# EasyEDA Pro project all_pcb.eprj

# Schematic Schematic1
Board Name: 前置差分放大; Create Date: 2024-09-15
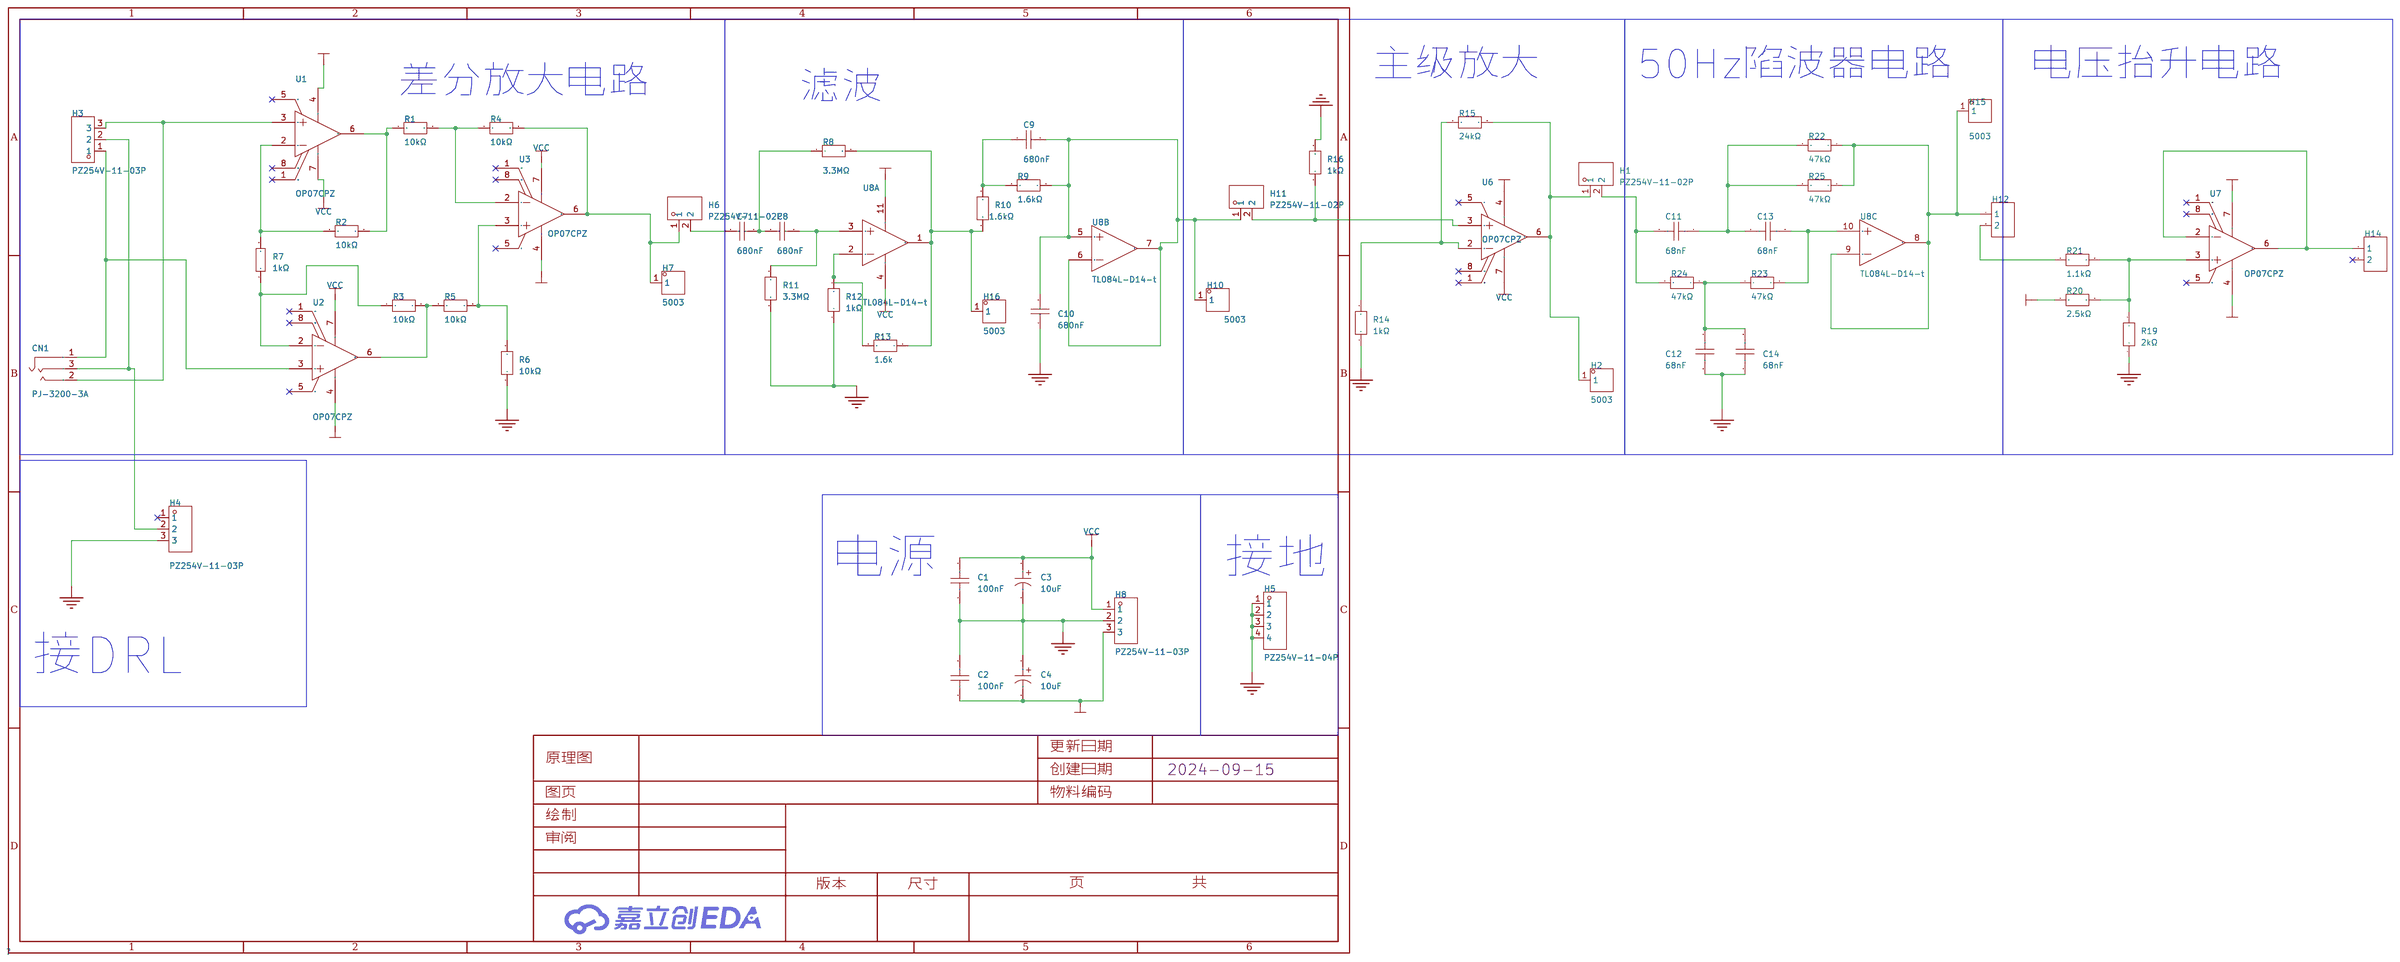
[diagram p0: schematic sheet]

## Parts
C1  100nF  [CAP-TH_L13.0-W6.0-P10.0-D0.6]
C2  100nF  [CAP-TH_L13.0-W6.0-P10.0-D0.6]
C3  10uF  [CAP-TH_BD10.0-P5.00-D0.6-FD]
C4  10uF  [CAP-TH_BD10.0-P5.00-D0.6-FD]
C7  680nF  [CAP-TH_L7.5-W6.5-P5.00-D0.5]
C8  680nF  [CAP-TH_L7.5-W6.5-P5.00-D0.5]
C9  680nF  [CAP-TH_L7.5-W6.5-P5.00-D0.5]
C10  680nF  [CAP-TH_L7.5-W6.5-P5.00-D0.5]
C11  68nF  [CAP-TH_L5.1-W3.8-P5.08-D1.2]
C12  68nF  [CAP-TH_L18.0-W8.0-P15.00-D0.8]
C13  68nF  [CAP-TH_L5.1-W3.8-P5.08-D1.2]
C14  68nF  [CAP-TH_L5.1-W3.8-P5.08-D1.2]
CN1  PJ-3200-3A  [AUDIO-TH_PJ-3200-3A]
H1  PZ254V-11-02P  [HDR-TH_2P-P2.54-V-M]
H2  5003  [TEST-TH_BD2.54-P1.39]
H3  PZ254V-11-03P  [HDR-TH_3P-P2.54-V-M]
H4  PZ254V-11-03P  [HDR-TH_3P-P2.54-V-M]
H5  PZ254V-11-04P  [HDR-TH_4P-P2.54-V-M]
H6  PZ254V-11-02P  [HDR-TH_2P-P2.54-V-M]
H7  5003  [TEST-TH_BD2.54-P1.39]
H8  PZ254V-11-03P  [HDR-TH_3P-P2.54-V-M]
H10  5003  [TEST-TH_BD2.54-P1.39]
H11  PZ254V-11-02P  [HDR-TH_2P-P2.54-V-M]
H12  -  [HDR-TH_2P-P2.54-V-F]
H14  -  [HDR-TH_2P-P2.54-V-F]
H15  5003  [TEST-TH_BD2.54-P1.39]
H16  5003  [TEST-TH_BD2.54-P1.39]
R1  10kΩ  [RES-TH_BD2.4-L6.3-P10.30-D0.6]
R2  10kΩ  [RES-TH_BD2.4-L6.3-P10.30-D0.6]
R3  10kΩ  [RES-TH_BD2.4-L6.3-P10.30-D0.6]
R4  10kΩ  [RES-TH_BD2.4-L6.3-P10.30-D0.6]
R5  10kΩ  [RES-TH_BD2.4-L6.3-P10.30-D0.6]
R6  10kΩ  [RES-TH_BD2.4-L6.3-P10.30-D0.6]
R7  1kΩ  [RES-TH_BD2.5-L6.5-P10.50-D0.6]
R8  3.3MΩ  [RES-TH_BD2.4-L6.3-P10.30-D0.6]
R9  1.6kΩ  [RES-TH_BD2.4-L6.3-P10.30-D0.6]
R10  1.6kΩ  [RES-TH_BD2.4-L6.3-P10.30-D0.6]
R11  3.3MΩ  [RES-TH_BD2.4-L6.3-P10.30-D0.6]
R12  1kΩ  [RES-TH_BD2.4-L6.3-P10.30-D0.6]
R13  1.6k  [RES-TH_BD2.4-L6.3-P10.30-D0.6]
R14  1kΩ  [RES-TH_BD2.4-L6.3-P10.30-D0.6]
R15  24kΩ  [RES-TH_BD2.4-L6.3-P10.30-D0.6]
R16  1kΩ  [RES-TH_BD2.4-L6.3-P10.30-D0.6]
R19  2kΩ  [RES-TH_BD2.3-L6.5-P10.50-D0.5]
R20  2.5kΩ  [RES-TH_BD4.6-L11.4-P15.40-D0.8]
R21  1.1kΩ  [RES-TH_BD3.3-L9.0-P13.00-D0.6]
R22  47kΩ  [RES-TH_BD2.3-L6.5-P10.50-D0.5]
R23  47kΩ  [RES-TH_BD2.4-L6.5-P10.50-D0.5]
R24  47kΩ  [RES-TH_BD2.4-L6.5-P10.50-D0.5]
R25  47kΩ  [RES-TH_BD3.3-L9.0-P13.00-D0.6]
U1  OP07CPZ  [PDIP-8_L9.3-W6.4-P2.54-LS7.6-BL]
U2  OP07CPZ  [PDIP-8_L9.3-W6.4-P2.54-LS7.6-BL]
U3  OP07CPZ  [PDIP-8_L9.3-W6.4-P2.54-LS7.6-BL]
U6  OP07CPZ  [PDIP-8_L9.3-W6.4-P2.54-LS7.6-BL]
U7  OP07CPZ  [PDIP-8_L9.3-W6.4-P2.54-LS7.6-BL]
U8  TL084L-D14-t  [PDIP-14_L19.3-W6.5-P2.54-LS7.6-BL]  (sections 1,2,3)

## Library data of the parts
C1 C2 = 1X2H410K275-11: LCSC Part Name: 等级:X2 100nF ±10% 275V; Supplier Part: C2846731; Manufacturer: BM(丰明电容); Supplier Footprint: 插件,P=10mm; JLCPCB Part Class: 扩展库; Datasheet: https://atta.szlcsc.com/upload/public/pdf/source/20210728/C2846732_DAC16FCBF90FAF4BF667A23B36E0C6E8.pdf; Supplier: LCSC; Tolerance: ±10%; Voltage(AC): 275V; Subclass: X2
C3 C4 = UCS2E100MPD1TD: LCSC Part Name: 10uF ±20% 250V; Supplier Part: C1579721; Manufacturer: Nichicon(尼吉康); Supplier Footprint: 插件; JLCPCB Part Class: 扩展库; Datasheet: https://atta.szlcsc.com/upload/public/pdf/source/20211009/4F4CA769B8C92F768087E64A1413DB40.pdf; Supplier: LCSC; Tolerance: ±20%; Rated Voltage: 250V; Ripple Current: 175mA@120Hz; Lead Spacing: 5mm; φD: 10mm; Lifetime @ Temp: 8000hrs@105℃; Operating Temperature: -40℃~+105℃
C7-C10 = PE684J2A0502: 容值:680nF;精度:±5%;额定电压:100V;工作温度:-40℃~+110℃;; LCSC Part Name: 680nF ±5% 100V; Supplier Part: C478437; Manufacturer: KYET(科雅); Supplier Footprint: 插件,P=5mm; JLCPCB Part Class: 扩展库; Datasheet: https://atta.szlcsc.com/upload/public/pdf/source/20200102/C478437_80764A5A52068CAA3BEDED5BEA089104.pdf; Supplier: LCSC; Tolerance: ±5%; Voltage Rated: 100V; Operating Temperature: -40℃~+110℃
C11 C13 C14 = C322C104KBR5TA: 容值:100nF;精度:±10%;额定电压:630V;温度系数:X7R;; LCSC Part Name: 100nF ±10% 630V; Supplier Part: C129685; Manufacturer: KEMET(基美); Supplier Footprint: 插件,P=5.08mm; JLCPCB Part Class: 扩展库; Datasheet: https://atta.szlcsc.com/upload/public/pdf/source/20180502/C129685_22A0E9A1A89AC8F69AAACD1F3AA6AB03.pdf; Supplier: LCSC; Tolerance: ±10%; Voltage Rated: 630V; Temperature Coefficient: X7R
C12 = B32922H3204M: 容值:200nF;精度:±20%;电压(AC):305V;等级:X2;; LCSC Part Name: 等级:X2 200nF ±20% 305V; Supplier Part: C3298878; Manufacturer: TDK; Supplier Footprint: 插件,P=15mm; JLCPCB Part Class: 扩展库; Datasheet: https://atta.szlcsc.com/upload/public/pdf/source/20240403/6B857094AE2B4215483F52CB5BD16209.pdf; Supplier: LCSC; Tolerance: ±20%; Voltage(AC): 305V; Subclass: X2; Operating Temperature: -40℃~+110℃
CN1 = PJ-3200-3A: LCSC Part Name: 3.5mm耳机座; Supplier Part: C709202; Manufacturer: 韩国韩荣; Supplier Footprint: 插件; JLCPCB Part Class: 扩展库; Datasheet: https://atta.szlcsc.com/upload/public/pdf/source/20201012/C709202_4DD47C61DF91E6337EB1570AC409C882.pdf; Supplier: LCSC; Connector Type: 3.5mm耳机座; Current Rating (Max): 500mA; Voltage Rating (Max): 30V; Operating Temperature Range: -20℃~+70℃
H1 H6 H11 = PZ254V-11-02P: LCSC Part Name: 间距:2.54mm 1x2P 直插 方针; Supplier Part: C492401; Manufacturer: XFCN(兴飞); Supplier Footprint: 插件,P=2.54mm; JLCPCB Part Class: 扩展库; Datasheet: https://atta.szlcsc.com/upload/public/pdf/source/20200309/C492401_A812433581A9B211A7FFA413ADDFF0E5.pdf; Supplier: LCSC; Pin Structure: 1x2P; Pitch: 2.54mm; Circluar Pins/Square Pins: 方针; Mounting Type: 直插; Number of Rows: 单排; Number of Pins: 2P; Length of Mating Pin: 6mm; Insulation Height: 2.5mm; Length of End Connection Pin: 3mm; Contact Material: 黄铜; Operating Temperature Range: -40℃~+105℃; Color: 黑色
H2 H7 H10 H15 H16 = 5003: Supplier Part: C238124; Manufacturer: Keystone; Datasheet: https://atta.szlcsc.com/upload/public/pdf/source/20211115/64B944F8418AA2CF0680BB1B201435FB.pdf; Supplier: LCSC; Type: 测试环; Overall Length/Height: 7.62mm; Contact Material: 磷青铜
H3 H4 H8 = PZ254V-11-03P: LCSC Part Name: 间距:2.54mm 1x3P 直插 方针; Supplier Part: C2937625; Manufacturer: XFCN(兴飞); Supplier Footprint: 插件,P=2.54mm; JLCPCB Part Class: 扩展库; Datasheet: https://atta.szlcsc.com/upload/public/pdf/source/20200309/C492402_8335C3D49C4E4C618838D59BB1D024C1.pdf; Supplier: LCSC; Pin Structure: 1x3P; Pitch: 2.54mm; Circluar Pins/Square Pins: 方针; Mounting Type: 直插; Number of Rows: 单排; Number of Pins: 3P; Current Rating (Max): 3A; Voltage Rating (Max): 250V; Length of Mating Pin: 6mm; Insulation Height: 2.5mm; Length of End Connection Pin: 3mm; Operating Temperature Range: -40℃~+105℃; Color: 黑色
H5 = PZ254V-11-04P: LCSC Part Name: 间距:2.54mm 1x4P 直插 方针; Supplier Part: C2691448; Manufacturer: XFCN(兴飞); Supplier Footprint: 插件,P=2.54mm; JLCPCB Part Class: 扩展库; Datasheet: https://atta.szlcsc.com/upload/public/pdf/source/20200309/C492403_F9F19131791D08044AD4F84F8E751A34.pdf; Supplier: LCSC; Pin Structure: 1x4P; Pitch: 2.54mm; Circluar Pins/Square Pins: 方针; Mounting Type: 直插; Number of Rows: 单排; Number of Pins: 4P; Current Rating (Max): 3A; Voltage Rating (Max): 250V; Length of Mating Pin: 6mm; Insulation Height: 2.5mm; Length of End Connection Pin: 3mm; Operating Temperature Range: -40℃~+105℃; Color: 黑色
H12 H14 = HDR-F_2.54_1x2P: Supplier Part: C49661; Supplier Footprint: 插件
R1-R6 R8-R16 = RN1/4W10KFT/BA1: LCSC Part Name: 10kΩ ±1% 250mW 金属膜电阻; Supplier Part: C410695; Manufacturer: Tyohm(幸亚电阻); Supplier Footprint: 插件,D2.4xL6.5mm; JLCPCB Part Class: 扩展库; Datasheet: https://atta.szlcsc.com/upload/public/pdf/source/20190808/C410699_D126E64D28B638F1D73B58E9F61DFD9B.pdf; Supplier: LCSC; Type: 金属膜电阻; Tolerance: ±1%; Overload Voltage (Max): 250V; Power(Watts): 250mW; Temperature Coefficient: ±50ppm/℃; Operating Temperature Range: -55℃~+125℃
R7 = MFR0W4F1001A50: LCSC Part Name: 1kΩ ±1% 250mW 金属膜电阻; Supplier Part: C57435; Manufacturer: UNI-ROYAL(厚声); Supplier Footprint: 插件,D2.2xL6.5mm; JLCPCB Part Class: 扩展库; Datasheet: https://atta.szlcsc.com/upload/public/pdf/source/20191012/C436293_8820AA14BC71FA35E551C06C441482A0.pdf; Supplier: LCSC; Type: 金属膜电阻; Tolerance: ±1%; Overload Voltage (Max): 250V; Power(Watts): 250mW; Temperature Coefficient: ±50ppm/℃
R19 = MF1/4W-2KΩ±1%T52: 电阻类型:金属膜电阻;阻值:2kΩ;精度:±1%;功率:250mW;温度系数:±200ppm/℃;; LCSC Part Name: 金属膜电阻 2kΩ ±1% 250mW; Supplier Part: C714001; Manufacturer: 华星机电; Supplier Footprint: 插件,D2.3xL6.5mm; JLCPCB Part Class: 扩展库; Datasheet: https://atta.szlcsc.com/upload/public/pdf/source/20200731/C713882_AE8EB1102749D7E4FB4FB13DC898C429.pdf; Supplier: LCSC; Type: 金属膜电阻; Tolerance: ±1%; Power(Watts): 250mW; Temperature Coefficient: ±200ppm/℃
R20 = WHC2K5FET: 电阻类型:绕线电阻;阻值:2.5kΩ;精度:±1%;功率:2W;温度系数:±20ppm/℃;; LCSC Part Name: 绕线电阻 2.5kΩ ±1% 2W; Supplier Part: C3505401; Manufacturer: Ohmite; Supplier Footprint: 插件,D4.6xL11.4mm; JLCPCB Part Class: 扩展库; Datasheet: https://atta.szlcsc.com/upload/public/pdf/source/20210417/087EAD1F647A2CF587132FB7AFBF5B0A.pdf; Supplier: LCSC; Type: 绕线电阻; Tolerance: ±1%; Power(Watts): 2W; Temperature Coefficient: ±20ppm/℃; Operating Temperature Range: -55℃~+150℃
R21 = RSF-50JR-52-1K1: 电阻类型:金属膜电阻;阻值:1.1kΩ;精度:±5%;功率:500mW;温度系数:±300ppm/℃;; LCSC Part Name: 金属膜电阻 1.1kΩ ±5% 500mW; Supplier Part: C1752465; Manufacturer: YAGEO(国巨); Supplier Footprint: 插件,D3.3xL9mm; JLCPCB Part Class: 扩展库; Datasheet: https://atta.szlcsc.com/upload/public/pdf/source/20200722/C705062_59B157870D59CA0881ABA296A8644ADF.pdf; Supplier: LCSC; Type: 金属膜电阻; Tolerance: ±5%; Power(Watts): 500mW; Temperature Coefficient: ±300ppm/℃; Operating Temperature Range: -55℃~+155℃
R22 = MF1/4W-5.1KΩ±1%T52: 电阻类型:金属膜电阻;阻值:5.1kΩ;精度:±1%;功率:250mW;温度系数:±200ppm/℃;; LCSC Part Name: 金属膜电阻 5.1kΩ ±1% 250mW; Supplier Part: C714010; Manufacturer: 华星机电; Supplier Footprint: 插件,D2.3xL6.5mm; Datasheet: https://atta.szlcsc.com/upload/public/pdf/source/20200731/C713882_AE8EB1102749D7E4FB4FB13DC898C429.pdf; Supplier: LCSC; Type: 金属膜电阻; Tolerance: ±1%; Power(Watts): 250mW; Temperature Coefficient: ±200ppm/℃
R23 R24 = RNF14BTE32K0: 电阻类型:金属膜电阻;阻值:32kΩ;精度:±0.1%;功率:250mW;温度系数:±25ppm/℃;; LCSC Part Name: 金属膜电阻 32kΩ ±0.1% 250mW; Supplier Part: C2592661; Manufacturer: SEI(Stackpole Electronics Inc.); Supplier Footprint: 插件,D2.4xL6.4mm; JLCPCB Part Class: 扩展库; Datasheet: https://atta.szlcsc.com/upload/public/pdf/source/20210416/CE3C3DFE1F0E2A8D22EC743938724C43.pdf; Supplier: LCSC; Type: 金属膜电阻; Tolerance: ±0.1%; Power(Watts): 250mW; Temperature Coefficient: ±25ppm/℃; Operating Temperature Range: -55℃~+155℃
R25 = RSF-50JT-52-16K: 电阻类型:金属膜电阻;阻值:16kΩ;精度:±5%;功率:500mW;温度系数:±300ppm/℃;; LCSC Part Name: 金属膜电阻 16kΩ ±5% 500mW; Supplier Part: C1377696; Manufacturer: YAGEO(国巨); Supplier Footprint: 插件,D3.3xL9mm; JLCPCB Part Class: 扩展库; Datasheet: https://atta.szlcsc.com/upload/public/pdf/source/20200722/C705062_59B157870D59CA0881ABA296A8644ADF.pdf; Supplier: LCSC; Type: 金属膜电阻; Tolerance: ±5%; Power(Watts): 500mW; Temperature Coefficient: ±300ppm/℃; Operating Temperature Range: -55℃~+155℃
U1-U3 U6 U7 = OP07CPZ: Supplier Part: C408829; Manufacturer: ADI(亚德诺); Supplier Footprint: PDIP-8; JLCPCB Part Class: 扩展库; Datasheet: https://atta.szlcsc.com/upload/public/pdf/source/20190807/C408829_BE0F3A08CC30F779D7ED20D5AC7364F9.pdf; Supplier: LCSC
U8 = TL084L-D14-t: Supplier Part: C7509603; Manufacturer: UTC(友顺); Supplier Footprint: DIP-14; JLCPCB Part Class: 扩展库; Datasheet: https://atta.szlcsc.com/upload/public/pdf/source/20230825/21103CE5C41335A2FDBC1DDE797A8A69.pdf; Supplier: LCSC

## Nets
GND: C1.1 C2.2 C3.2 C4.1 C10.1 C12.2 C14.1 H4.3 H5.1 H5.2 H5.3 H5.4 H8.2 R6.1 R11.1 R12.1 R14.1 R16.2 R19.1
VCC: C1.2 C3.1 H8.1 R20.1 U1.7(V+) U2.7(V+) U3.7(V+) U6.7(V+) U7.7(V+) U8.4(V+)
VEE: C2.1 C4.2 H8.3 U1.4(V-) U2.4(V-) U3.4(V-) U6.4(V-) U7.4(V-) U8.11(V-)
$1N1148: CN1.2 H3.3 U1.3(IN+)
$1N1174: R3.1 R7.1 U2.2(IN-)
$1N1182: CN1.1 H3.1 U2.3(IN+)
$1N1311: R2.2 R7.2 U1.2(IN-)
$1N1319: R1.1 R2.1 U1.6(OUT)
$1N1379: R3.2 R5.1 U2.6(OUT)
$1N1397: R1.2 R4.1 U3.2(IN-)
$1N1420: R5.2 R6.2 U3.3(IN+)
$1N1452: H6.1 H7.1 R4.2 U3.6(OUT)
$1N2211: CN1.3 H3.2 H4.2
$1N4885: C7.2 C8.1 R8.1
$1N4886: C8.2 R11.2 U8.3(IN1+)
$1N4888: R12.2 R13.2 U8.2(IN1-)
$1N4890: H16.1 R8.2 R10.1 R13.1 U8.1(OUT1)
$1N4893: C9.1 R9.1 R10.2
$1N5273: C7.1 H6.2
$1N6829: R14.2 R15.1 U6.2(IN-)
$1N6834: H11.2 R16.1 U6.3(IN+)
$1N8038: H1.1 H2.1 R15.2 U6.6(OUT)
$1N9831: R19.2 R20.2 R21.2 U7.3(IN+)
$1N9836: H14.1 U7.2(IN-) U7.6(OUT)
$1N15205: C9.2 C10.2 H10.1 H11.1 R9.2 U8.5(IN2+) U8.6(IN2-) U8.7(OUT2)
$1N20142: C11.1 C13.1 R22.2 R25.2
$1N20149: C11.2 H1.2 R24.2
$1N20183: C13.2 R23.2 U8.10(IN3+)
$1N20208: C12.1 C14.2 R23.1 R24.1
$1N20244: H12.2 R21.1
$1N20257: H12.1 H15.1 R22.1 R25.1 U8.8(OUT3) U8.9(IN3-)

Not connected (* = marked no-connect by the designer): H4 1*; H14 2*; U1 1(VOS_TRIM)* 5(NC)* 8(VOS_TRIM)*; U2 1(VOS_TRIM)* 5(NC)* 8(VOS_TRIM)*; U3 1(VOS_TRIM)* 5(NC)* 8(VOS_TRIM)*; U6 1(VOS_TRIM)* 5(NC)* 8(VOS_TRIM)*; U7 1(VOS_TRIM)* 5(NC)* 8(VOS_TRIM)*

## Notes on the sheet
- 主级放大
- 50Hz陷波器电路
- 电压抬升电路
- 差分放大电路
- 滤波
- 电源
- 接地
- 接DRL

# Board PCB6
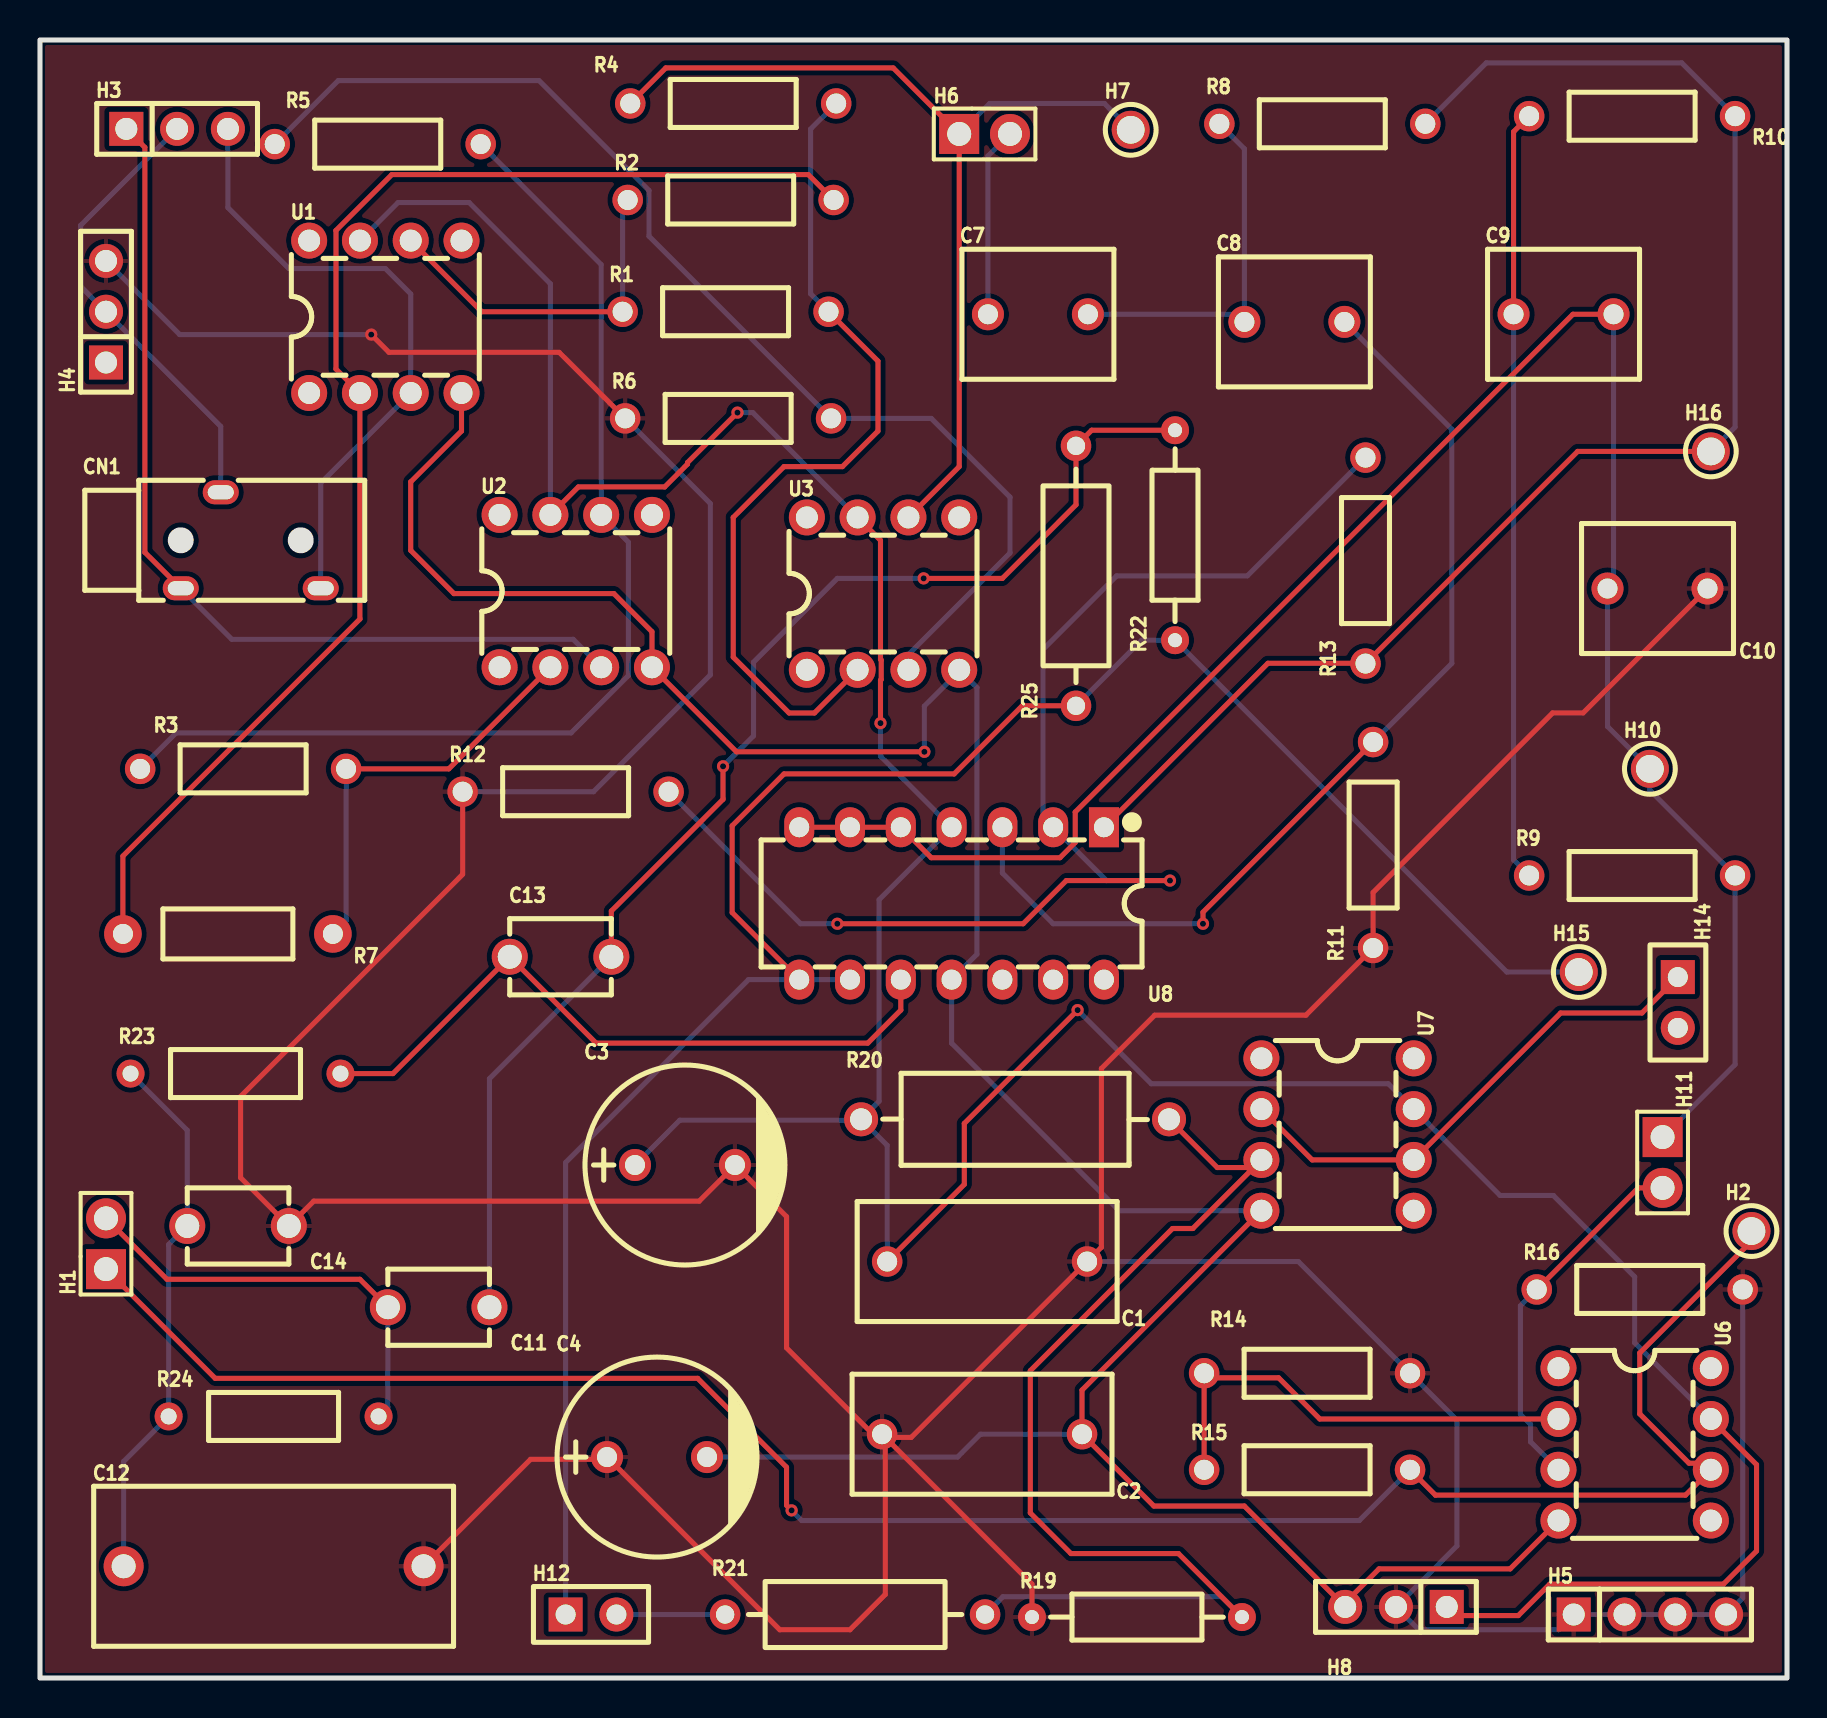
[diagram p1: board, top side]
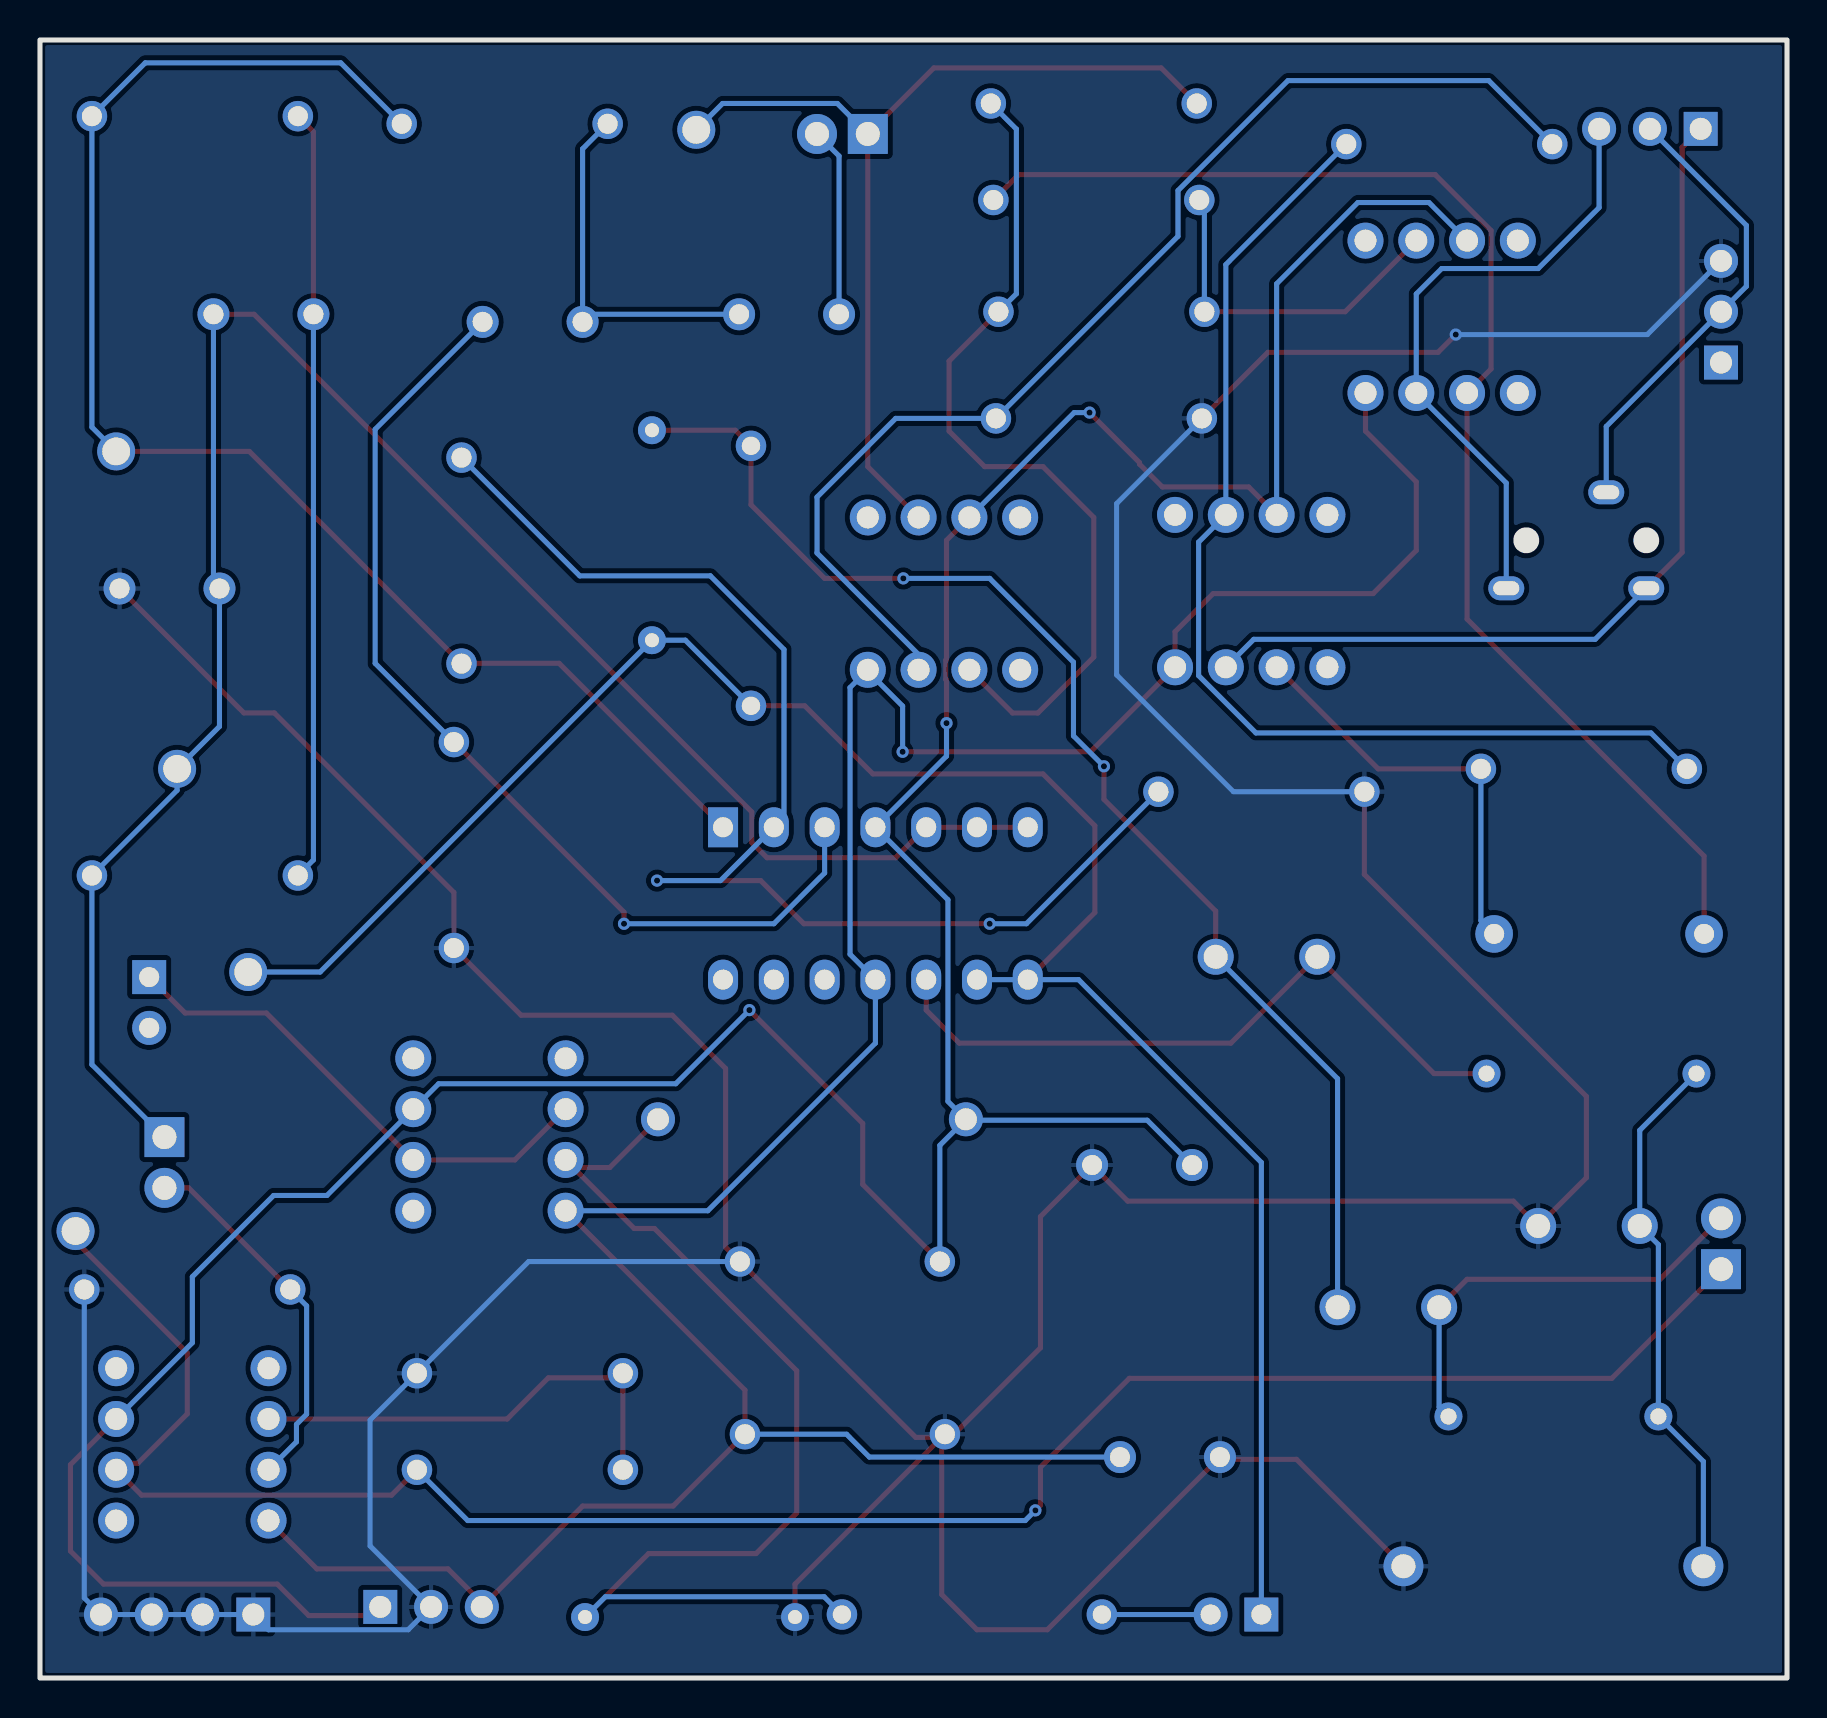
[diagram p2: board, bottom side, seen from below]

Outline 87.38 x 81.91 mm; copper layers: Top Layer, Bottom Layer. Coordinates in mm from the lower left corner of the outline.
Outline path: rectangle 0,81.91 87.38,0
Stack: Top Layer 0.035mm / Dielectric1 1.51mm FR4 er 4.5 / Bottom Layer 0.035mm

## Design rules (mm)
template: JLCPCB Capability(Two Layers Board)
spacing copperThickness1oz (default): track to track 0.102, other pairs 0.152 to 0.3
spacing copperThickness2oz: track to track 0.203, other pairs 0.152 to 0.3
track width copperThickness1oz (default): min 0.127, default 0.254, max 2.54
track width copperThickness2oz: min 0.203, default 0.254, max 2.54
differential pair differentialPair (default): width min 0.127, default 0.254, max 2.54; gap min 0.152, default 0.152
via viaSize (default): diameter min 0.5, default 0.61, max 10; hole min 0.3, default 0.305, max 6.3

## Placement (name value [footprint] x y rotation side)
C1  100nF  [CAP-TH_L13.0-W6.0-P10.0-D0.6]  47.37 20.83 180 top
C2  100nF  [CAP-TH_L13.0-W6.0-P10.0-D0.6]  47.12 12.19 180 top
C3  10uF  [CAP-TH_BD10.0-P5.00-D0.6-FD]  32.26 25.65 0 top
C4  10uF  [CAP-TH_BD10.0-P5.00-D0.6-FD]  30.86 11.05 0 top
C7  680nF  [CAP-TH_L7.5-W6.5-P5.00-D0.5]  49.91 68.2 0 top
C8  680nF  [CAP-TH_L7.5-W6.5-P5.00-D0.5]  62.74 67.82 0 top
C9  680nF  [CAP-TH_L7.5-W6.5-P5.00-D0.5]  76.2 68.2 0 top
C10  680nF  [CAP-TH_L7.5-W6.5-P5.00-D0.5]  80.9 54.48 180 top
C11  68nF  [CAP-TH_L5.1-W3.8-P5.08-D1.2]  19.94 18.54 180 top
C12  68nF  [CAP-TH_L18.0-W8.0-P15.00-D0.8]  11.68 5.59 0 top
C13  68nF  [CAP-TH_L5.1-W3.8-P5.08-D1.2]  26.03 36.07 180 top
C14  68nF  [CAP-TH_L5.1-W3.8-P5.08-D1.2]  9.91 22.61 180 top
CN1  PJ-3200-3A  [AUDIO-TH_PJ-3200-3A]  10.54 56.9 0 top
H1  PZ254V-11-02P  [HDR-TH_2P-P2.54-V-M]  3.3 21.72 90 top
H2  5003  [TEST-TH_BD2.54-P1.39]  85.6 22.35 0 top
H3  PZ254V-11-03P  [HDR-TH_3P-P2.54-V-M]  6.86 77.47 0 top
H4  PZ254V-11-03P  [HDR-TH_3P-P2.54-V-M]  3.3 68.33 90 top
H5  PZ254V-11-04P  [HDR-TH_4P-P2.54-V-M]  80.52 3.17 0 top
H6  PZ254V-11-02P  [HDR-TH_2P-P2.54-V-M]  47.24 77.22 0 top
H7  5003  [TEST-TH_BD2.54-P1.39]  54.55 77.42 0 top
H8  PZ254V-11-03P  [HDR-TH_3P-P2.54-V-M]  67.82 3.56 180 top
H10  5003  [TEST-TH_BD2.54-P1.39]  80.52 45.47 0 top
H11  PZ254V-11-02P  [HDR-TH_2P-P2.54-V-M]  81.15 25.78 270 top
H12  -  [HDR-TH_2P-P2.54-V-F]  27.56 3.17 0 top
H14  -  [HDR-TH_2P-P2.54-V-F]  81.91 33.78 270 top
H15  5003  [TEST-TH_BD2.54-P1.39]  76.96 35.31 0 top
H16  5003  [TEST-TH_BD2.54-P1.39]  83.57 61.34 0 top
R1  10kΩ  [RES-TH_BD2.4-L6.3-P10.30-D0.6]  34.29 68.33 0 top
R2  10kΩ  [RES-TH_BD2.4-L6.3-P10.30-D0.6]  34.54 73.91 0 top
R3  10kΩ  [RES-TH_BD2.4-L6.3-P10.30-D0.6]  10.16 45.47 180 top
R4  10kΩ  [RES-TH_BD2.4-L6.3-P10.30-D0.6]  34.67 78.74 180 top
R5  10kΩ  [RES-TH_BD2.4-L6.3-P10.30-D0.6]  16.89 76.71 180 top
R6  10kΩ  [RES-TH_BD2.4-L6.3-P10.30-D0.6]  34.42 62.99 0 top
R7  1kΩ  [RES-TH_BD2.5-L6.5-P10.50-D0.6]  9.4 37.21 180 top
R8  3.3MΩ  [RES-TH_BD2.4-L6.3-P10.30-D0.6]  64.13 77.72 0 top
R9  1.6kΩ  [RES-TH_BD2.4-L6.3-P10.30-D0.6]  79.63 40.13 0 top
R10  1.6kΩ  [RES-TH_BD2.4-L6.3-P10.30-D0.6]  79.63 78.1 180 top
R11  3.3MΩ  [RES-TH_BD2.4-L6.3-P10.30-D0.6]  66.68 41.66 90 top
R12  1kΩ  [RES-TH_BD2.4-L6.3-P10.30-D0.6]  26.29 44.32 0 top
R13  1.6k  [RES-TH_BD2.4-L6.3-P10.30-D0.6]  66.29 55.88 90 top
R14  1kΩ  [RES-TH_BD2.4-L6.3-P10.30-D0.6]  63.37 15.24 180 top
R15  24kΩ  [RES-TH_BD2.4-L6.3-P10.30-D0.6]  63.37 10.41 0 top
R16  1kΩ  [RES-TH_BD2.4-L6.3-P10.30-D0.6]  80.01 19.43 0 top
R19  2kΩ  [RES-TH_BD2.3-L6.5-P10.50-D0.5]  54.86 3.05 0 top
R20  2.5kΩ  [RES-TH_BD4.6-L11.4-P15.40-D0.8]  48.77 27.94 0 top
R21  1.1kΩ  [RES-TH_BD3.3-L9.0-P13.00-D0.6]  40.77 3.17 0 top
R22  47kΩ  [RES-TH_BD2.3-L6.5-P10.50-D0.5]  56.77 57.15 90 top
R23  47kΩ  [RES-TH_BD2.4-L6.5-P10.50-D0.5]  9.78 30.23 0 top
R24  47kΩ  [RES-TH_BD2.4-L6.5-P10.50-D0.5]  11.68 13.08 0 top
R25  47kΩ  [RES-TH_BD3.3-L9.0-P13.00-D0.6]  51.82 55.12 90 top
U1  OP07CPZ  [PDIP-8_L9.3-W6.4-P2.54-LS7.6-BL]  17.27 68.07 0 top
U2  OP07CPZ  [PDIP-8_L9.3-W6.4-P2.54-LS7.6-BL]  26.8 54.36 0 top
U3  OP07CPZ  [PDIP-8_L9.3-W6.4-P2.54-LS7.6-BL]  42.16 54.23 0 top
U6  OP07CPZ  [PDIP-8_L9.3-W6.4-P2.54-LS7.6-BL]  79.76 11.68 270 top
U7  OP07CPZ  [PDIP-8_L9.3-W6.4-P2.54-LS7.6-BL]  64.9 27.18 270 top
U8  TL084L-D14-t  [PDIP-14_L19.3-W6.5-P2.54-LS7.6-BL]  45.59 38.73 180 top

## Footprints (pads in the part's own frame, mm; a bottom-side part is the same pattern mirrored in y, then rotated)
AUDIO-TH_PJ-3200-3A
  oval 1.8x1.2 hole 1.3x0.7: 1(-3.5,-2.4) 2(3.5,-2.4) 3(-1.5,2.4)
CAP-TH_BD10.0-P5.00-D0.6-FD
  round 1.6 hole 1: 1(-2.5,0) 2(2.5,0)
CAP-TH_L5.1-W3.8-P5.08-D1.2
  round 1.8 hole 1.2: 1(-2.54,0) 2(2.54,0)
CAP-TH_L7.5-W6.5-P5.00-D0.5
  round 1.6 hole 1: 1(-2.5,0) 2(2.5,0)
CAP-TH_L13.0-W6.0-P10.0-D0.6
  round 1.524 hole 1: 1(-5,0) 2(5,0)
CAP-TH_L18.0-W8.0-P15.00-D0.8
  round 2 hole 1.2: 1(-7.5,0) 2(7.5,0)
HDR-TH_2P-P2.54-V-F
  rect 1.7x1.7 hole 1: 1(-1.27,0)
  round 1.7 hole 1: 2(1.27,0)
HDR-TH_2P-P2.54-V-M
  rect 2x2 hole 1.2: 1(-1.27,0)
  round 2 hole 1.2: 2(1.27,0)
HDR-TH_3P-P2.54-V-M
  rect 1.7x1.7 hole 1.1: 1(-2.54,0)
  round 1.7 hole 1.1: 2(0,0) 3(2.54,0)
HDR-TH_4P-P2.54-V-M
  rect 1.7x1.7 hole 1.1: 1(-3.81,0)
  round 1.7 hole 1.1: 2(-1.27,0) 3(1.27,0) 4(3.81,0)
PDIP-8_L9.3-W6.4-P2.54-LS7.6-BL
  round 1.8 hole 1.1: 1(-3.81,-3.81) 2(-1.27,-3.81) 3(1.27,-3.81) 4(3.81,-3.81) 5(3.81,3.81) 6(1.27,3.81) 7(-1.27,3.81) 8(-3.81,3.81)
PDIP-14_L19.3-W6.5-P2.54-LS7.6-BL
  rect 1.5x2 hole 1: 1(-7.62,-3.81)
  oval 1.5x2 hole 1: 2(-5.08,-3.81) 3(-2.54,-3.81) 4(0,-3.81) 5(2.54,-3.81) 6(5.08,-3.81) 7(7.62,-3.81) 8(7.62,3.81) 9(5.08,3.81) 10(2.54,3.81) 11(0,3.81) 12(-2.54,3.81) 13(-5.08,3.81) 14(-7.62,3.81)
RES-TH_BD2.3-L6.5-P10.50-D0.5
  round 1.4 hole 0.7: 1(-5.25,0) 2(5.25,0)
RES-TH_BD2.4-L6.3-P10.30-D0.6
  round 1.524 hole 1: 1(-5.15,0) 2(5.15,0)
RES-TH_BD2.4-L6.5-P10.50-D0.5
  round 1.4 hole 0.8: 1(-5.25,0) 2(5.25,0)
RES-TH_BD2.5-L6.5-P10.50-D0.6
  round 1.879 hole 1: 1(-5.25,0) 2(5.25,0)
RES-TH_BD3.3-L9.0-P13.00-D0.6
  round 1.524 hole 0.914: 1(-6.5,0) 2(6.5,0)
RES-TH_BD4.6-L11.4-P15.40-D0.8
  round 1.7 hole 1.1: 1(-7.7,0) 2(7.7,0)
TEST-TH_BD2.54-P1.39
  round 1.9 hole 1.39: 1(0,0)

## Nets
As in the schematic.

Pads without a net: H4 1; H14 2; U1 1 5 8; U2 1 5 8; U3 1 5 8; U6 1 5 8; U7 1 5 8; U8 12 13 14

## Via types
v1: diameter 0.61, hole 0.305, Top Layer to Bottom Layer, 11 vias

## Routing (per net, layer and track width the routed paths; a pad name or vN(x,y) marks a point on that pad's centre or on a via; arc(x,y) is an arc through that point)
GND: length 307.9
  Top Layer w0.254: 34.77,25.64 32.97,23.85 13.69,23.85 C14.1 10.03,25.02 10.03,29.08 21.14,40.19 21.14,44.32 ; 34.77,25.64 37.34,23.07 37.34,16.51 41.66,12.19 C2.2 42.28,12.03 ; 34.77,25.64 C3.2 ; v1(16.57,67.18) 17.46,66.29 25.97,66.29 R6.1 ; 28.36,10.94 24.53,10.94 C12.2 ; 42.28,12.03 42.28,4.18 40.51,2.41 37,2.41 C4.1 ; 42.28,12.03 49.61,4.69 R19.1 ; 42.28,12.03 43.58,12.03 C1.1 53.09,21.54 53.09,30.48 55.75,33.15 63.32,33.15 R11.1 66.68,39.28 75.66,48.26 77.18,48.26 C10.1
  Bottom Layer w0.254: R6.1 33.53,58.73 33.53,50.16 27.69,44.32 21.14,44.32 ; C1.1 62.94,20.83 R14.1 70.87,12.9 70.87,6.6 H8.2 68.96,2.41 75.95,2.41 H5.1 H5.2 H5.3 H5.4 85.16,4.01 R16.2 ; v1(16.57,67.18) 6.98,67.18 H4.3
VCC: length 180.3
  Top Layer w0.254: U2.7 26.92,59.56 31.24,59.56 32.38,60.71 32.38,60.78 v1(34.88,63.28) ; v1(51.9,33.4) 46.23,27.73 46.23,24.68 C1.2 ; U3.7 42.04,56.9 42.04,50.94 42.07,50.91 42.07,49.93 42.04,49.89 v1(42.04,47.75) ; H8.1 70.79,3.12 73.94,3.12 75.51,4.7 84.2,4.7 85.85,6.35 85.85,10.67 U6.7
  Bottom Layer w0.254: 41.11,27.89 R20.1 41.97,28.84 41.97,38.92 U8.4 42.04,46.1 v1(42.04,47.75) ; 41.11,27.89 32,27.89 C3.1 ; 41.11,27.89 42.37,26.64 C1.2 ; U6.7 79.76,16.76 79.76,20.07 75.69,24.13 73.03,24.13 U7.7 67.44,29.72 55.58,29.72 v1(51.9,33.4) ; U1.7 17.91,73.79 21.46,73.79 25.53,69.72 U2.7 ; U3.7 35.65,63.28 v1(34.88,63.28)
VEE: length 146.5
  Top Layer w0.254: v1(44.23,46.32) 34.83,46.32 U2.4 30.61,52.32 28.7,54.23 20.7,54.23 18.54,56.39 18.54,59.82 21.08,62.36 U1.4 ; 65.17,3.66 66.97,5.46 73.53,5.46 U6.4 ; 65.17,3.66 H8.3 ; 65.17,3.66 60.23,8.6 55.71,8.6 C2.1 52.12,14.4 U7.4
  Bottom Layer w0.254: v1(44.23,46.32) 44.23,48.6 46.01,50.38 ; U7.4 53.97,23.37 45.59,31.75 45.59,34.92 46.86,36.19 46.86,49.53 46.01,50.38 ; C4.2 45.89,11.05 47.04,12.19 C2.1 ; 46.01,50.38 U3.4
$1N1148: length 31.5
  Bottom Layer w0.254: H3.3 9.4,73.53 12.45,70.48 17.27,70.48 18.54,69.21 U1.3 14.04,59.76 CN1.2
$1N1174: length 20.9
  Top Layer w0.254: R3.1 20.45,45.47 U2.2
  Bottom Layer w0.254: R3.1 15.31,37.87 R7.1
$1N1182: length 46.8
  Top Layer w0.254: CN1.1 5.25,56.29 5.25,76.54 H3.1
  Bottom Layer w0.254: CN1.1 9.59,51.94 26.67,51.94 U2.3
$1N1311: length 67.2
  Top Layer w0.254: R7.2 4.15,41.1 16,52.96 U1.2 14.8,65.46 14.8,72.39 17.6,75.18 38.42,75.18 R2.2
$1N1319: length 17.8
  Top Layer w0.254: R1.1 22.1,68.33 U1.6
  Bottom Layer w0.254: R2.1 29.14,73.66 R1.1
$1N1379: length 56
  Bottom Layer w0.254: R5.1 28.07,70.68 U2.6 29.43,56.8 29.43,50.13 26.56,47.26 6.81,47.26 R3.2
$1N1397: length 42.6
  Top Layer w0.254: U3.2 38.74,48.26 37.47,48.26 34.67,51.05 34.67,58.04 37.21,60.58 40.13,60.58 41.91,62.36 41.91,65.86 R1.2
  Bottom Layer w0.254: R4.1 38.54,77.46 38.54,69.22 R1.2
$1N1420: length 58.8
  Bottom Layer w0.254: R5.2 14.92,79.88 24.96,79.88 30.46,74.39 30.46,72.1 R6.2 44.58,62.99 48.51,59.05 48.51,56.26 43.43,51.18 U3.3
$1N1452: length 48.5
  Top Layer w0.254: R4.2 31.3,80.52 42.67,80.52 H6.1 45.97,60.58 U3.6
  Bottom Layer w0.254: H6.1 47.5,78.74 53.24,78.74 H7.1
$1N2211: length 23.1
  Bottom Layer w0.254: H3.2 2.03,72.64 2.03,69.6 H4.2 9.04,62.59 CN1.3
$1N4885: length 18.4
  Bottom Layer w0.254: 58.99,77.72 60.24,76.47 C8.1 59.86,68.2 C7.2
$1N4886: length 50.9
  Top Layer w0.254: R11.2 58.17,38.3 v1(58.17,37.72)
  Bottom Layer w0.254: 48.13,42.54 48.13,40.26 50.67,37.72 v1(58.17,37.72) ; C8.2 70.61,62.44 70.61,50.74 R11.2
$1N4888: length 64.9
  Top Layer w0.254: v1(56.51,39.88) 51.33,39.88 49.17,37.72 v1(39.88,37.72)
  Bottom Layer w0.254: v1(56.51,39.88) 53.34,39.88 U8.2 50.16,43.05 50.16,51.43 53.85,55.12 60.38,55.12 R13.2 ; R12.2 38.04,37.72 v1(39.88,37.72)
$1N4890: length 73.3
  Top Layer w0.254: 66.31,50.74 76.91,61.34 H16.1 ; 66.31,50.74 61.41,50.74 U8.1 ; 66.31,50.74 R13.1
  Bottom Layer w0.254: R8.2 72.33,80.77 82.11,80.77 R10.1 84.78,62.55 H16.1
$1N4893: length 38.6
  Top Layer w0.254: C9.1 73.7,77.33 R10.2
  Bottom Layer w0.254: R9.1 73.7,40.91 C9.1
$1N5273: length 9.5
  Bottom Layer w0.254: C7.1 47.41,76.11 H6.2
$1N6829: length 23.4
  Top Layer w0.254: R14.2 58.22,15.01 ; 58.22,15.01 61.95,15.01 64.01,12.95 U6.2 ; 58.22,15.01 R15.1
$1N6834: length 18.5
  Top Layer w0.254: R16.1 79.94,24.51 H11.2
  Bottom Layer w0.254: U6.3 74.55,11.81 74.55,12.68 74.04,13.19 74.04,18.61 R16.1
$1N8038: length 104.9
  Top Layer w0.254: 3.3,20.45 8.76,14.99 32.89,14.99 37.34,10.54 37.34,8.64 v1(37.59,8.38) ; R15.2 69.79,9.14 82.3,9.14 U6.6 83.24,10.74 82.48,10.74 80.01,13.21 80.01,16.26 85.6,21.84 H2.1
  Bottom Layer w0.254: v1(37.59,8.38) 38.1,7.87 65.98,7.87 R15.2
$1N9831: length 54.6
  Top Layer w0.254: R19.2 56.94,6.22 51.56,6.22 49.53,8.25 49.53,15.37 56.64,22.48 57.66,22.48 60.71,25.53 ; 60.71,25.53 58.88,25.53 R20.2 ; 60.71,25.53 U7.3
  Bottom Layer w0.254: R21.2 48.16,4.06 59.1,4.06 R19.2
$1N9836: length 25.7
  Top Layer w0.254: U7.2 63.63,25.91 U7.6 76.06,33.26 80.12,33.26 H14.1
$1N15205: length 98.9
  Top Layer w0.254: 37.97,42.54 U8.5 44.58,41.02 51.01,41.02 51.78,41.78 51.78,43.31 76.67,68.2 C9.2
  Bottom Layer w0.254: H11.1 84.78,30.68 R9.2 80.52,44.39 H10.1 78.4,47.58 C10.2 78.7,54.78 C9.2
$1N20142: length 65.3
  Top Layer w0.254: v1(44.2,54.99) 48.13,54.99 51.82,58.67 R25.2 52.6,62.4 R22.2 ; v1(34.16,45.59) 34.16,43.94 28.57,38.35 C13.1
  Bottom Layer w0.254: C11.1 22.48,29.97 C13.1 ; v1(34.16,45.59) 35.69,47.12 35.69,50.8 39.88,54.99 v1(44.2,54.99)
$1N20149: length 21.6
  Top Layer w0.254: H1.2 6.35,19.94 16,19.94 C11.2
  Bottom Layer w0.254: R24.2 17.4,13.55 C11.2
$1N20183: length 34.4
  Top Layer w0.254: R23.2 17.65,30.23 C13.2 27.81,31.75 41.4,31.75 43.05,33.4 43.05,34.92
$1N20208: length 27.1
  Bottom Layer w0.254: C12.1 4.18,10.83 R24.1 6.43,21.67 C14.2 7.37,27.39 R23.1
$1N20244: length 5.4
  Bottom Layer w0.254: H12.2 R21.1
$1N20257: length 102.8
  Top Layer w0.254: R25.1 49.13,48.62 45.72,45.21 37.21,45.21 34.62,42.62 34.62,38.28 37.97,34.92
  Bottom Layer w0.254: H12.1 26.29,25.78 35.43,34.92 40.51,34.92 ; H15.1 73.36,35.31 R22.1 55.1,51.9 R25.1

## Copper pours and planes (outline as drawn; the poured copper is in the pictures)
GND on Top Layer: -0.25,81.66 86.75,81.66 86.75,0 -0.25,0
GND on Top Layer: 0,81.91 87.38,81.91 87.38,0 0,0
GND on Bottom Layer: 0,81.64 86.98,81.64 86.98,0 0,0
GND on Bottom Layer: -0.64,82.3 87.76,82.3 87.76,-0.51 -0.64,-0.51
